# EAGLE schematic NT_RadioModule (EAGLE 9.6.2)
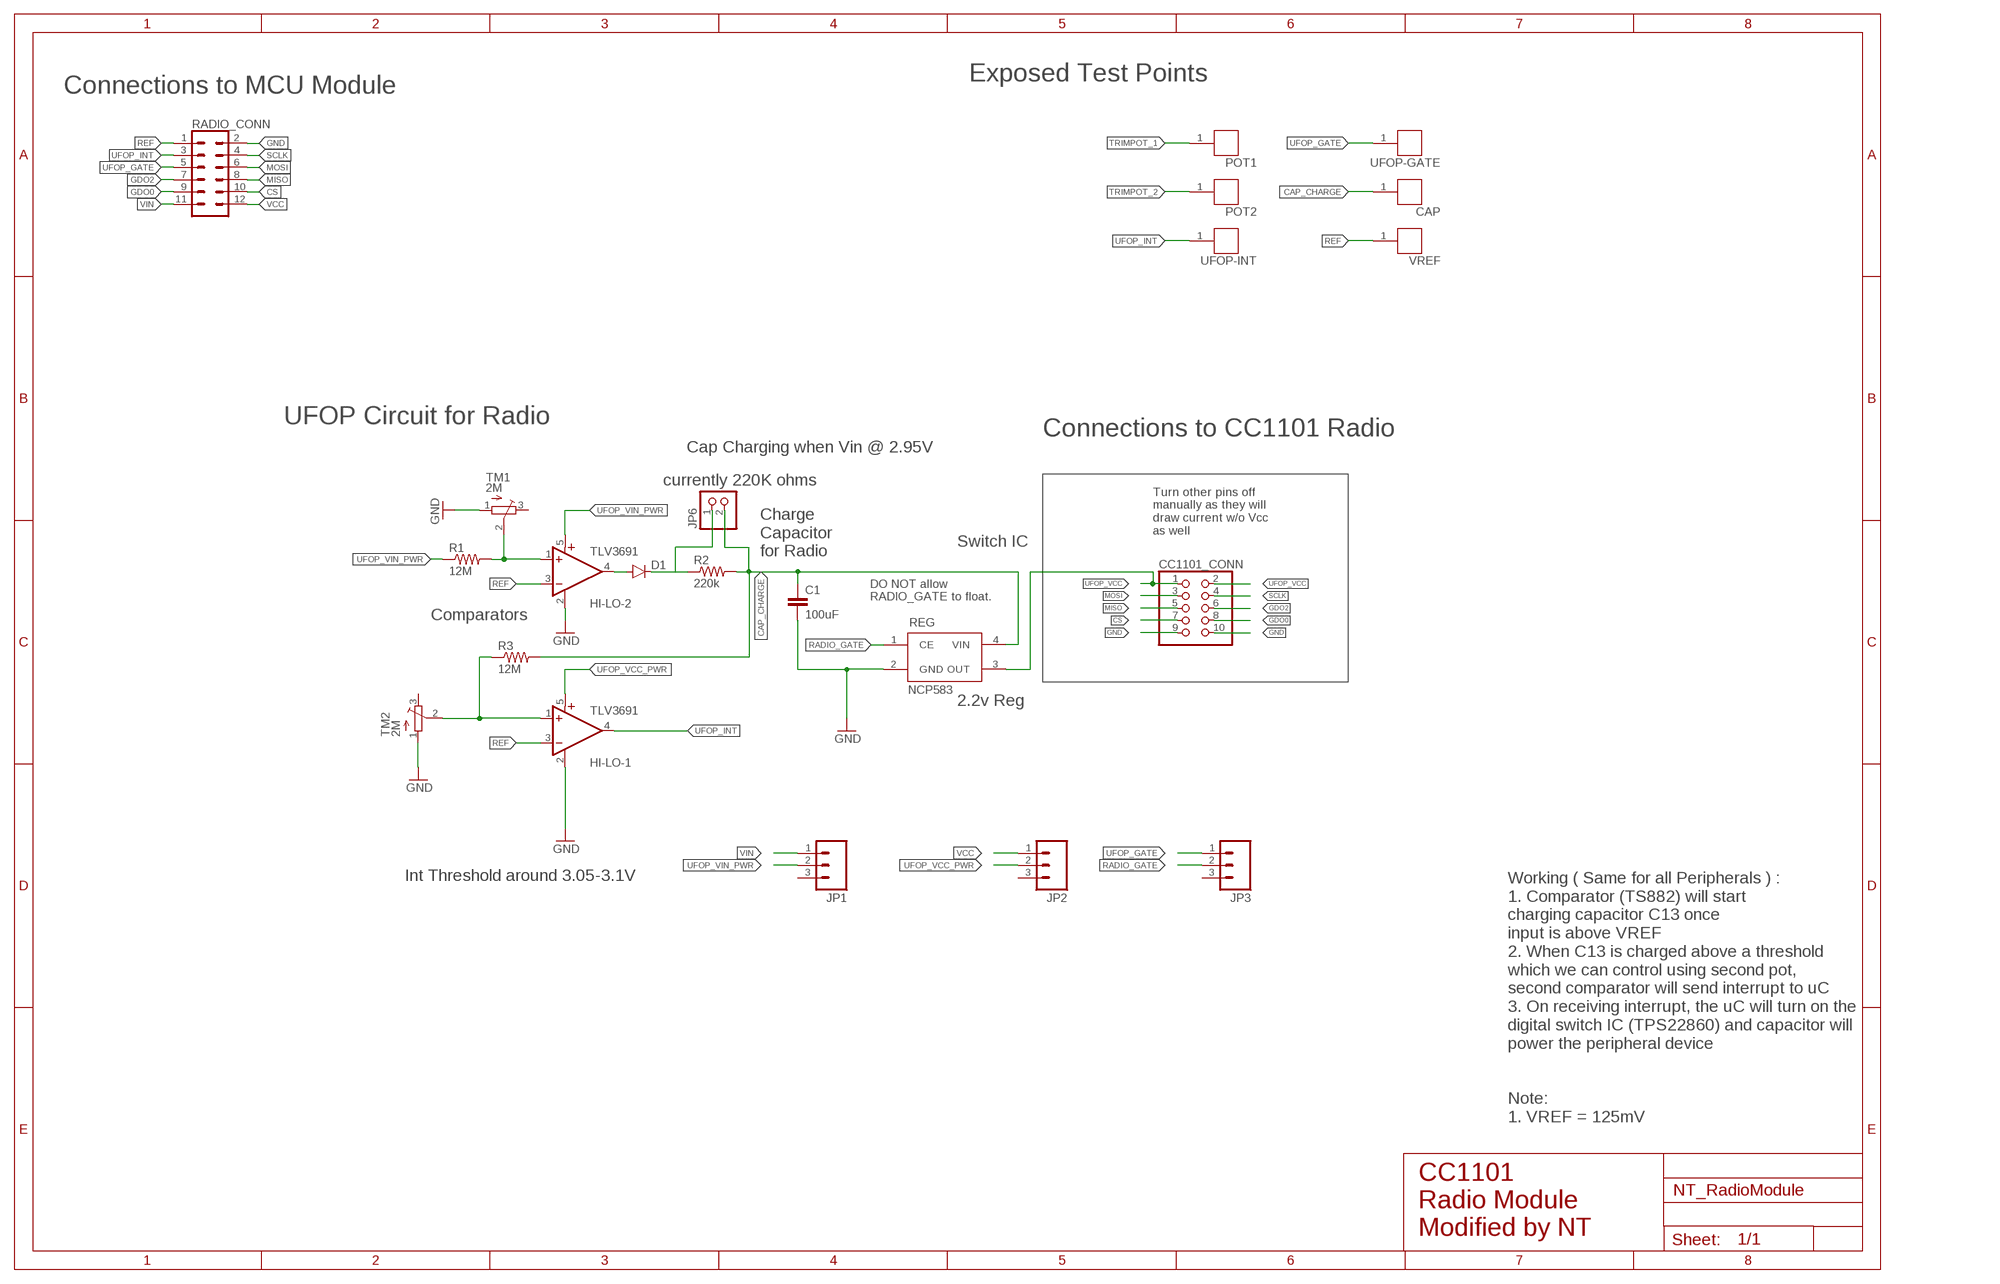
[diagram p0: schematic, sheet 1]

## Parts
C1  100uF  CAP0603-CAP  [0603-CAP]
CAP  RCU-0C  [TE_RCU-0C]
CC1101_CONN  PINHD-2X5  [2X05]
D1  DIODESOD523  [SOD523]
HI-LO-1  TLV3691  [SC70-5]
HI-LO-2  TLV3691  [SC70-5]
JP1  M03  [1X03-1.27MM]
JP2  M03  [1X03-1.27MM]
JP3  M03  [1X03-1.27MM]
JP6  PINHD-1X2  [1X02]
POT1  RCU-0C  [TE_RCU-0C]
POT2  RCU-0C  [TE_RCU-0C]
R1  12M  RESISTOR0603  [0603-RES]
R2  220k  RESISTOR0603  [0603-RES]
R3  12M  RESISTOR0603  [0603-RES]
RADIO_CONN  CONN_06X2PTH_FEMALE  [2X6]
REG  NCP583  [SC82-AB_1PRIMARY]
TM1  2M  TRIMPOTTC33X  [TC33X]
TM2  2M  TRIMPOTTC33X  [TC33X]
UFOP-GATE  RCU-0C  [TE_RCU-0C]
UFOP-INT  RCU-0C  [TE_RCU-0C]
VREF  RCU-0C  [TE_RCU-0C]

## Nets
CAP_CHARGE: C1.1 CAP.1 JP6.2 R2.2 R3.2 REG.4(VIN)
CS: CC1101_CONN.7 RADIO_CONN.10
GDO0: CC1101_CONN.8 RADIO_CONN.9
GDO2: CC1101_CONN.6 RADIO_CONN.7
GND: C1.2 CC1101_CONN.9 CC1101_CONN.10 HI-LO-1.2(GND) HI-LO-2.2(GND) RADIO_CONN.2 REG.2(GND) TM1.1(A) TM2.1(A)
MISO: CC1101_CONN.5 RADIO_CONN.8
MOSI: CC1101_CONN.3 RADIO_CONN.6
N$1: D1.C JP6.1 R2.1
N$24: D1.A HI-LO-2.4(OUT)
RADIO_GATE: JP3.2 REG.1(CE)
REF: HI-LO-1.3(-IN) HI-LO-2.3(-IN) RADIO_CONN.1 VREF.1
SCLK: CC1101_CONN.4 RADIO_CONN.4
TRIMPOT_1: HI-LO-2.1(+IN) POT1.1 R1.2 TM1.2(S)
TRIMPOT_2: HI-LO-1.1(+IN) POT2.1 R3.1 TM2.2(S)
UFOP_GATE: JP3.1 RADIO_CONN.5 UFOP-GATE.1
UFOP_INT: HI-LO-1.4(OUT) RADIO_CONN.3 UFOP-INT.1
UFOP_VCC: CC1101_CONN.1 CC1101_CONN.2 REG.3(OUT)
UFOP_VCC_PWR: HI-LO-1.5(V+) JP2.2
UFOP_VIN_PWR: HI-LO-2.5(V+) JP1.2 R1.1
VCC: JP2.1 RADIO_CONN.12
VIN: JP1.1 RADIO_CONN.11
Unconnected: JP1.3 JP2.3 JP3.3 TM1.3(E) TM2.3(E)

## Notes on the sheet
- Exposed Test Points
- Connections to MCU Module
- UFOP Circuit for Radio
- Connections to CC1101 Radio
- Cap Charging when Vin @ 2.95V
- currently 220K ohms
- Charge 
  Capacitor 
  for Radio
- Turn other pins off 
  manually as they will
  draw current w/o Vcc
  as well
- Switch IC
- DO NOT allow 
  RADIO_GATE to float.
- Comparators
- 2.2v Reg
- Int Threshold around 3.05-3.1V
- Working ( Same for all Peripherals ) :
  1. Comparator (TS882) will start 
  charging capacitor C13 once 
  input is above VREF
  2. When C13 is charged above a threshold
  which we can control using second pot, 
  second comparator will send interrupt to uC
  3. On receiving interrupt, the uC will turn on the
  digital switch IC (TPS22860) and capacitor will 
  power the peripheral device
- Note:
  1. VREF = 125mV
- CC1101
  Radio Module
  Modified by NT

## Library data of the parts
C1 = SparkFun-Capacitors:CAP: Capacitor Standard 0603 ceramic capacitor, and 0.1" leaded capacitor.; DIGIKEY: 490-9969-1-ND
CAP POT1 POT2 UFOP-GATE UFOP-INT VREF = RCU-0C:RCU-0C: 0603 PROBE PAD; AVAILABILITY: Unavailable; COMMENT: RCU-0C _1625854-3_; DESCRIPTION: 0603 PROBE PAD; EU_ROHS_COMPLIANCE: Compliant; LINK: http://www.te.com/usa-en/product-1625854-3.html; MF: TE Connectivity; MP: RCU-0C; PACKAGE: 0603; POWER_RATING: 0 W; PRICE: None; RESISTANCE: <.05; TOLERANCE: 0%
CC1101_CONN = pinhead:PINHD-2X5: PIN HEADER
D1 = SparkFun-DiscreteSemi:DIODE: Diode These are standard reverse protection diodes and small signal diodes. SMA package can handle up to about 1A. SOD-323 can handle about 200mA. What the SOD-323 package when ordering, there are some mfgs out there that are 5-pin packages.
HI-LO-1 HI-LO-2 = fedpower:TLV3691: 0.9-V to 6.5-V, Nanopower Comparator Datasheets Analog Signal Chain Guide <http://www.ti.com/lit/pdf/slyb174> TLV3691 <http://www.ti.com/lit/ds/symlink/tlv3691.pdf> Manufacturer Product Page TLV3691IDPFR Specifications <http://www.ti.com/general/docs/suppproductinfo.tsp?distId=10&orderablePartNumber=TLV3691IDPFR> Standard Package <javascript:dlgHelp('Standard%20Packaging%20Help');> 1 Category Integrated Circuits (ICs) </product-search/en/integrated-circuits-ics> Family Linear - Comparators </product-search/en/integrated-circuits-ics/linear-comparators/2556221> Series - Packaging <javascript:dlgHelp('Standard%20Packaging%20Help');> Cut Tape (CT) <javascript:dlgHelp('Cut%20Tape%20Help');> Type General Purpose Number of Elements 1 Output Type Push-Pull Voltage - Supply, Single/Dual (±) 0.9 V ~ 6.5 V, ±0.45 V ~ 3.25 V Voltage - Input Offset (Max) 3mV Current - Input Bias (Max) 100pA Current - Output (Typ) 42mA Current - Quiescent (Max) 150nA CMRR, PSRR (Typ) - Propagation Delay (Max) 35µs Hysteresis - Operating Temperature -40°C ~ 125°C Package / Case 6-XFDFN Mounting Type Surface Mount Supplier Device Package 6-X2SON (1x1) Online Catalog Comparators - 1 element </catalog/en/partgroup/comparators-1-element/3112?mpart=TLV3691IDPFR&vendor=296&WT.z_ref_page_type=PS&WT.z_ref_page_sub_type=PD&WT.z_ref_page_id=PD&WT.z_ref_page_event=DC_Link_Table> Other Names 296-37242-1
JP1-JP3 = SparkFun-Connectors:M03: Header 3 Standard 3-pin 0.1" header. Use with straight break away headers (SKU : PRT-00116), right angle break away headers (PRT-00553), swiss pins (PRT-00743), machine pins (PRT-00117), and female headers (PRT-00115). Molex polarized connector foot print use with SKU : PRT-08232 with associated crimp pins and housings.
JP6 = pinhead:PINHD-1X2: PIN HEADER
R1 = SparkFun-Resistors:RESISTOR: Resistor Basic schematic elements and footprints for 0603, 1206, and PTH resistors.
R2 R3 = SparkFun-Resistors:RESISTOR: Resistor Basic schematic elements and footprints for 0603, 1206, and PTH resistors.; DIGIKEY: 311-2.00MHRCT-ND
RADIO_CONN = SparkFun-Connectors:CONN_06X2: Multi connection point. Often used as Generic Header-pin footprint for 0.1 inch spaced/style header connections On any of the 0.1 inch spaced packages, you can populate with these: Break Away Headers - Straight <https://www.sparkfun.com/products/116> (PRT-00116) Break Away Male Headers - Right Angle <https://www.sparkfun.com/products/553> (PRT-00553) Female Headers <https://www.sparkfun.com/products/115> (PRT-00115) Break Away Headers - Machine Pin <https://www.sparkfun.com/products/117> (PRT-00117) Break Away Female Headers - Swiss Machine Pin <https://www.sparkfun.com/products/743> (PRT-00743); PROD_ID: CONN-12423; VALUE: 2X6 FEMALE
REG = ncp583:NCP583: NCP583 - Ultra-Low Iq 150 mA CMOS LDO Regulator with Enable The NCP583 series of low dropout regulators are designed for portable battery powered applications which require precise output voltage accuracy and low quiescent current. These devices feature an enable function which lowers current consumption significantly and are offered in two small packages; SC−82AB and the SOT−563. A 1.0 mF ceramic capacitor is the recommended value to be used with these devices on the output pin.
TM1 TM2 = adafruit:TRIMPOT: SMT trimmer potentiometer part number TC33X http://www.ladyada.net/library/eagle